# Altium schematic sheet SerialLvlConvert.SchDoc
size A; DocumentNumber: 7; SheetNumber: 7; SheetTotal: 8
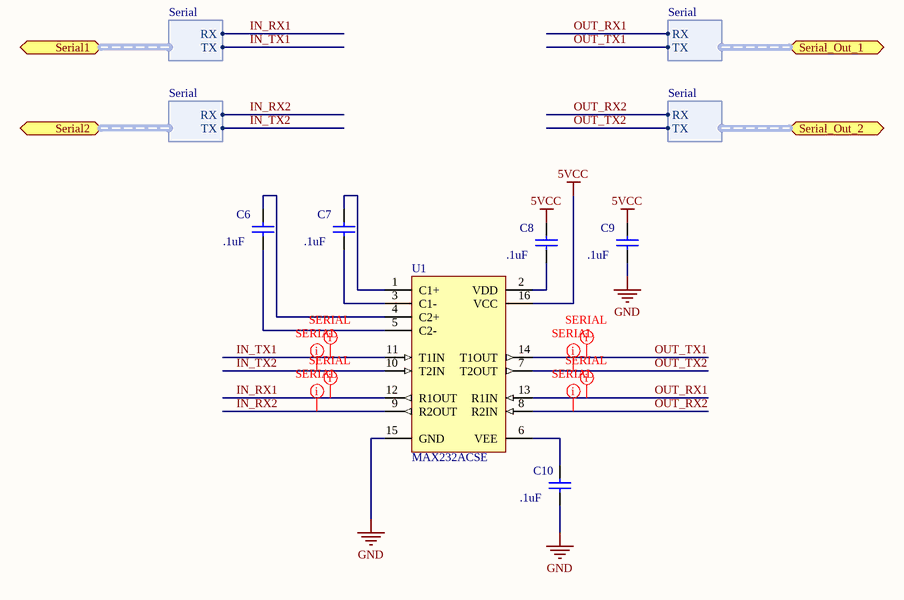
[diagram p0: SerialLvlConvert.SchDoc]

## Parts
C6  value .1uF  [0402]  (hidden comment: Cap Semi)
C7  value .1uF  [0402]  (hidden comment: Cap Semi)
C8  value .1uF  [0402]  (hidden comment: Cap Semi)
C9  value .1uF  [0402]  (hidden comment: Cap Semi)
C10  value .1uF  [0402]  (hidden comment: Cap Semi)
U1  MAX232ACSE  [NSO16_N]

## Ports
Serial1 (harness Serial), Serial2 (harness Serial), Serial_Out_1 (harness Serial), Serial_Out_2 (harness Serial)

## Harnesses
Serial: RX, TX

## Nets
5VCC: C8.1 C9.1 U1.16(VCC)
GND: C9.2 C10.2 U1.15(GND)
IN_RX1: U1.12(R1OUT) ; port Serial1.RX
IN_RX2: U1.9(R2OUT) ; port Serial2.RX
IN_TX1: U1.11(T1IN) ; port Serial1.TX
IN_TX2: U1.10(T2IN) ; port Serial2.TX
OUT_RX1: U1.13(R1IN) ; port Serial_Out_1.RX
OUT_RX2: U1.8(R2IN) ; port Serial_Out_2.RX
OUT_TX1: U1.14(T1OUT) ; port Serial_Out_1.TX
OUT_TX2: U1.7(T2OUT) ; port Serial_Out_2.TX
NetC6_1: C6.1 U1.4(C2+)
NetC6_2: C6.2 U1.5(C2-)
NetC7_1: C7.1 U1.1(C1+)
NetC7_2: C7.2 U1.3(C1-)
NetC8_2: C8.2 U1.2(VDD)
NetC10_1: C10.1 U1.6(VEE)

## Layout directives
rule Width Constraint [Pref Width = 5mil    Min Width = 5mil    Max Width = 5mil]; rule Length Constraint [Min Length = 0mil    Max Length = 6500mil]; rule Differential Pairs Routing [Pref Gap = 4mil    Min Gap  = 4mil    Max Gap  = 4mil]; rule Matched Net Lengths [Tolerance = 3000mil]; net class USB: IN_RX1, IN_RX2, IN_TX1, IN_TX2, OUT_RX1, OUT_RX2, OUT_TX1, OUT_TX2

## Library data of the parts
C6-C10 = Cap Semi: Capacitor (Semiconductor SIM Model); Published: 8-Jun-2000; LatestRevisionDate: 17-Jul-2002; LatestRevisionNote: Re-released for DXP Platform.; PackageReference: C1206; Publisher: Altium Limited; Supplier Part Number: 490-1318-1-ND; Supplier: Digi-Key
U1 = MAX232ACSE: +5V Powered, Multi-Channel RS-232 Driver/Receiver; Published: 16-Jan-2001; LatestRevisionDate: 13-Apr-2006; LatestRevisionNote: IPC-7351 Footprint Added.; PackageReference: NSO16; Publisher: Altium Limited; PackageDescription: 16-Pin Small Outline Integrated Circuit 1.27 mm Pitch; Code_JEDEC: MS-012-AC; Code_IPC: SOIC127P600-16; ComponentLink1Description: Manufacturer Link; ComponentLink1URL: http://www.maxim-ic.com/; ComponentLink2Description: Datasheet; ComponentLink2URL: http://pdfserv.maxim-ic.com/en/ds/MAX220-MAX249.pdf; Supplier Part Number: 52K5506; Supplier: Newark